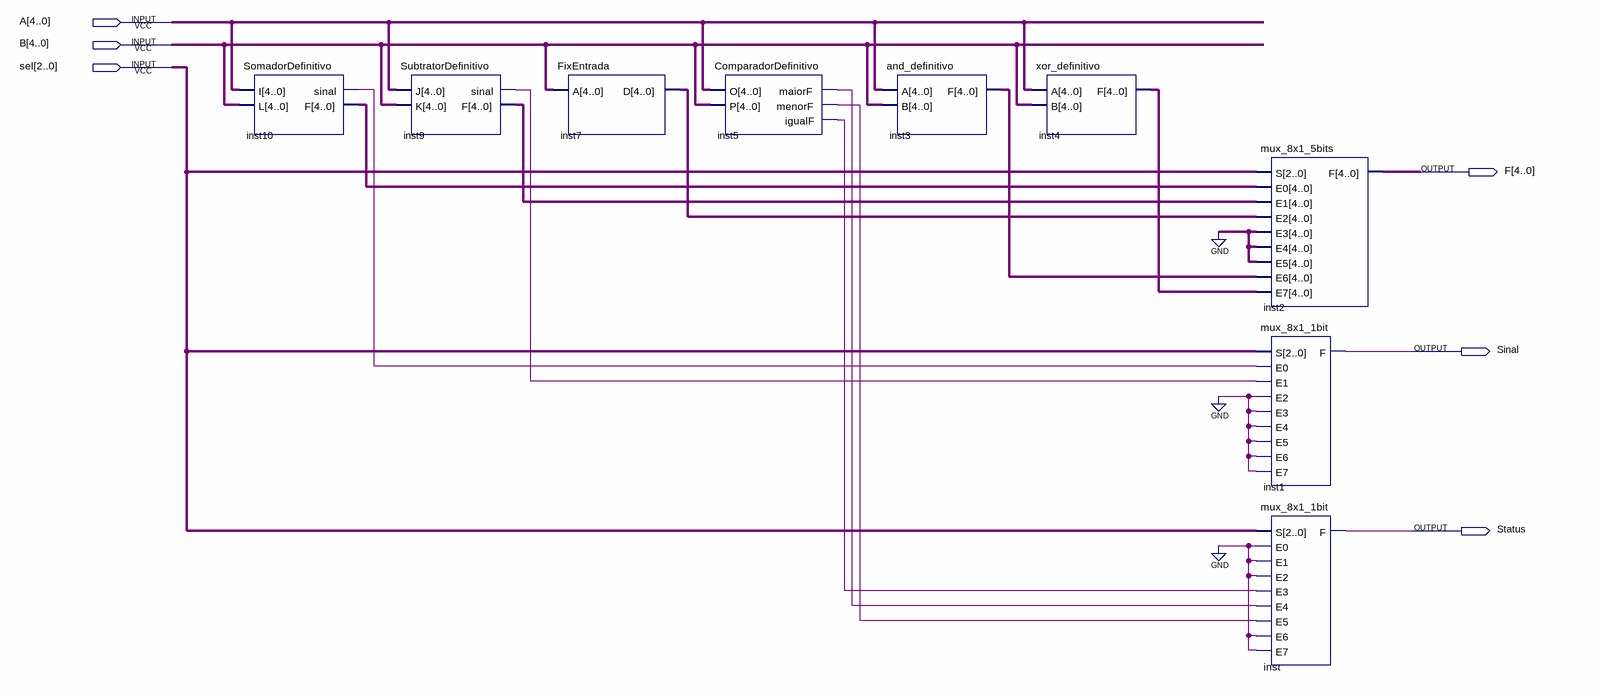
[diagram p0: schematic sheet]
// Quartus schematic ULA.bdf as structural Verilog: 9 symbols, 6 pins
module ULA (
  input  [4:0] A,
  input  [4:0] B,
  input  [2:0] sel,
  output [4:0] F,
  output Sinal,
  output Status
);

  wire inst5_igualf, inst5_maiorf, inst5_menorf, inst9_sinal, inst10_sinal;
  wire [4:0] inst3_f, inst4_f, inst7_d, inst9_f, inst10_f;

  SomadorDefinitivo inst10 (.I(A), .L(B), .sinal(inst10_sinal), .F(inst10_f));
  SubtratorDefinitivo inst9 (.J(A), .K(B), .sinal(inst9_sinal), .F(inst9_f));
  FixEntrada inst7 (.A(B), .D(inst7_d));
  ComparadorDefinitivo inst5 (.O(A), .P(B), .maiorF(inst5_maiorf), .menorF(inst5_menorf), .igualF(inst5_igualf));
  and_definitivo inst3 (.A(A), .B(B), .F(inst3_f));
  xor_definitivo inst4 (.A(A), .B(B), .F(inst4_f));
  mux_8x1_5bits inst2 (
    .S(sel), .E0(inst10_f), .E1(inst9_f), .E2(inst7_d), .E3({5{1'b0}}), .E4({5{1'b0}}), .E5({5{1'b0}}),
    .E6(inst3_f), .E7(inst4_f), .F(F));
  mux_8x1_1bit inst1 (
    .S(sel), .E0(inst10_sinal), .E1(inst9_sinal), .E2(1'b0), .E3(1'b0), .E4(1'b0), .E5(1'b0), .E6(1'b0),
    .E7(1'b0), .F(Sinal));
  mux_8x1_1bit inst (
    .S(sel), .E0(1'b0), .E1(1'b0), .E2(1'b0), .E3(inst5_igualf), .E4(inst5_maiorf), .E5(inst5_menorf),
    .E6(1'b0), .E7(1'b0), .F(Status));
endmodule
